# Altium project 迷你打印机.PrjPcb
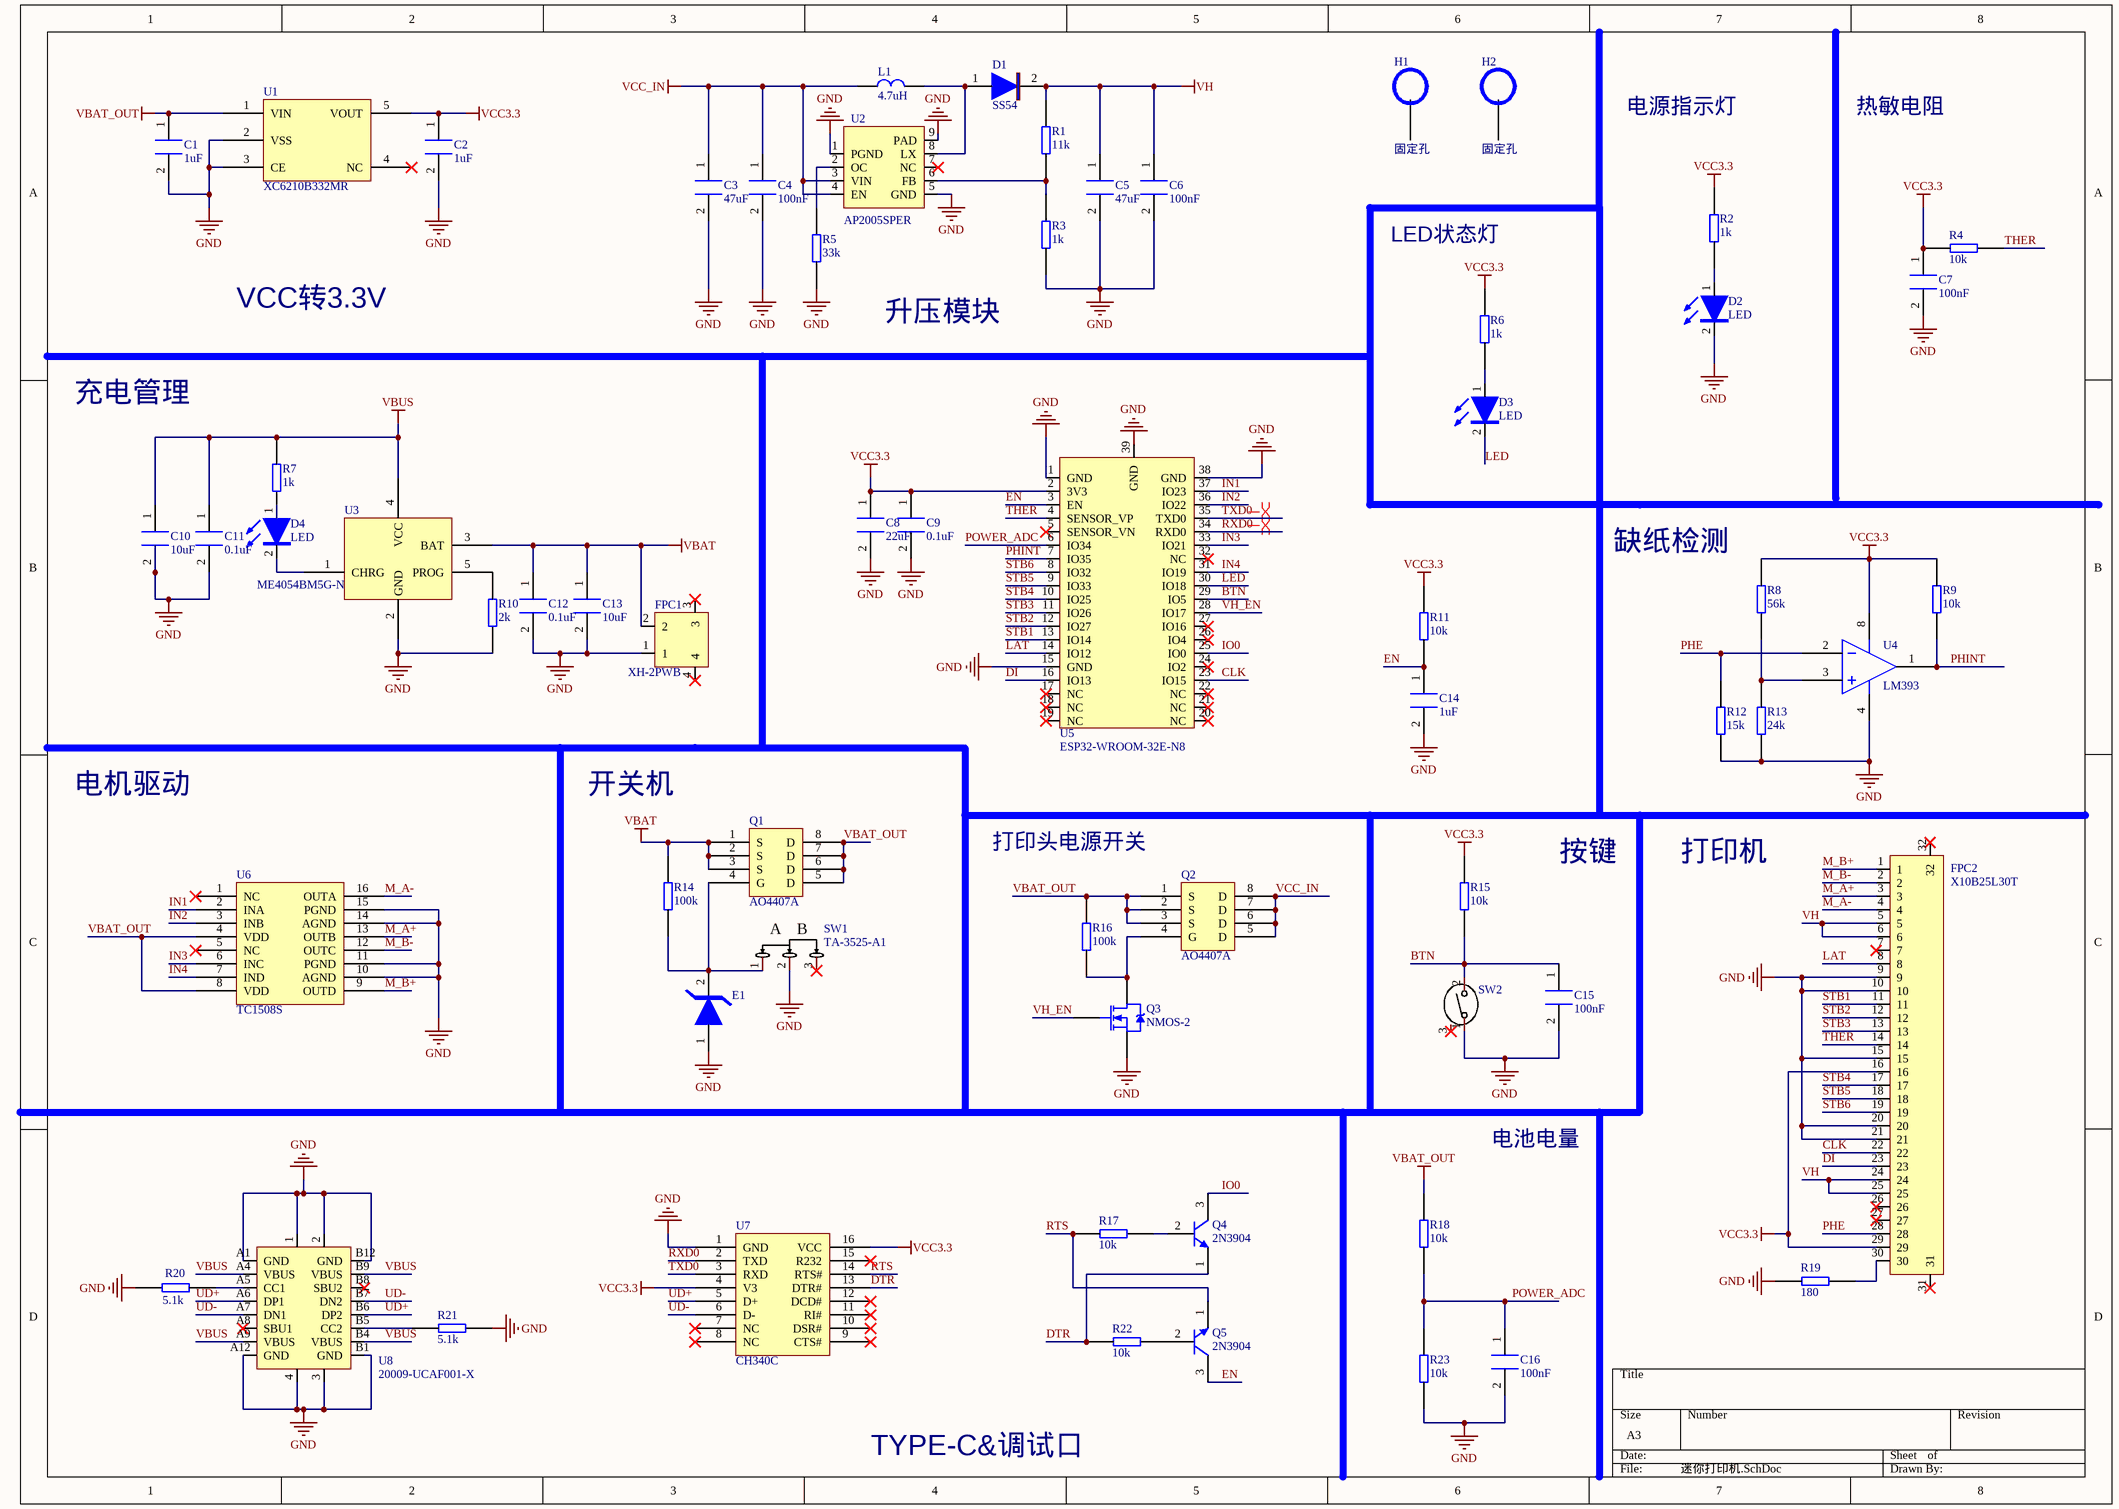
[diagram p0: 迷你打印机.SchDoc]
1 sheet, 64 parts. Net scope: global (net labels, ports and power ports of the same name join across sheets).
Board file: 迷你打印机.PcbDoc

## Sheet 迷你打印机.SchDoc
size A3

### Parts
C1  1uF  [0603C]
C2  1uF  [0603C]
C3  47uF  [0603C]
C4  100nF  [0603C]
C5  47uF  [0603C]
C6  100nF  [0603C]
C7  100nF  [0603C]
C8  22uF  [0603C]
C9  0.1uF  [0603C]
C10  10uF  [0603C]
C11  0.1uF  [0603C]
C12  0.1uF  [0603C]
C13  10uF  [0603C]
C14  1uF  [0603C]
C15  100nF  [0603C]
C16  100nF  [0603C]
D1  SS54  [SMA]
D2  LED  [0805D]
D3  LED  [0805D]
D4  LED  [0805D]
E1  单向ESD  [SOD323]  (value not drawn)
FPC1  XH-2PWB  [CONN-SMD_2P-P2.50_XH-2PWB]
FPC2  X10B25L30T  [FPC-SMD_X10B25U30T]
H1  固定孔  [铜柱孔3]
H2  固定孔  [铜柱孔3]
L1  4.7uH  [IND-SMD_L5.4-W5.2_FXL0530]
Q1  AO4407A  [SOP8]
Q2  AO4407A  [SOP8]
Q3  NMOS-2  [SOT23-3]
Q4  2N3904  [SOT23-3]
Q5  2N3904  [SOT23-3]
R1  11k  [0603R]
R2  1k  [0603R]
R3  1k  [0603R]
R4  10k  [0603R]
R5  33k  [0603R]
R6  1k  [0603R]
R7  1k  [0603R]
R8  56k  [0603R]
R9  10k  [0603R]
R10  2k  [0603R]
R11  10k  [0603R]
R12  15k  [0603R]
R13  24k  [0603R]
R14  100k  [0603R]
R15  10k  [0603R]
R16  100k  [0603R]
R17  10k  [0603R]
R18  10k  [0603R]
R19  180  [0603R]
R20  5.1k  [0603R]
R21  5.1k  [0603R]
R22  10k  [0603R]
R23  10k  [0603R]
SW1  TA-3525-A1  [SW-SMD_3P-L9.1-W3.5-P2.50-EH6.8]
SW2  TS4538B3JTP 250gf 121  [KEY-SMD_3P-L4.5-W3.8-P3.00-LS4.5-BL]  (value not drawn)
U1  XC6210B332MR  [SOT23-5]
U2  AP2005SPER  [ESOP-8_L4.9-W3.9-P1.27-LS6.0-BL-EP]
U3  ME4054BM5G-N  [SOT23-5]
U4  LM393  [SOP8]
U5  ESP32-WROOM-32E-N8  [WIFI-SMD_ESP32-WROOM-32E]
U6  TC1508S  [SOP16]
U7  CH340C  [SOP16]
U8  20009-UCAF001-X  [TYPE-C-SMD_20009-UCAF001-X]

### Nets
GND: C1.2 C2.2 C3.2 C4.2 C5.2 C6.2 C7.2 C8.2 C9.2 C10.2 C11.2 C12.2 C13.2 C14.2 C15.2 C16.2 D2.2 E1.1 FPC1.1 FPC2.9 FPC2.10 FPC2.15 FPC2.20 FPC2.21 Q3.3(S) R3.2 R5.2 R10.1 R12.1 R13.1 R19.2 R20.1 R21.1 R23.2 SW1.2 SW2.1 U1.2(VSS) U1.3(CE) U2.1(PGND) U2.5(GND) U2.9(PAD) U3.2(GND) U4.4(V-) U5.1(GND) U5.15(GND) U5.38(GND) U5.39(GND) U6.10(AGND) U6.11(PGND) U6.14(AGND) U6.15(PGND) U7.1(GND) U8.1 U8.2 U8.3 U8.4 U8.A1(GND) U8.A12(GND) U8.B1(GND) U8.B12(GND)
VBAT: C12.1 C13.1 FPC1.2 Q1.1(S) Q1.2(S) Q1.3(S) R14.1 U3.3(BAT)
VBAT_OUT: C1.1 Q1.5(D) Q1.6(D) Q1.7(D) Q1.8(D) Q2.1(S) Q2.2(S) Q2.3(S) R16.1 R18.1 U1.1(VIN) U6.4(VDD) U6.8(VDD)
VBUS: C10.1 C11.1 R7.2 U3.4(VCC) U8.A4(VBUS) U8.A9(VBUS) U8.B4(VBUS) U8.B9(VBUS)
VCC3.3: C2.1 C7.1 C8.1 C9.1 FPC2.16 FPC2.29 R2.1 R4.2 R6.1 R8.2 R9.2 R11.1 R15.2 U1.5(VOUT) U4.8(V+) U5.2(3V3) U7.4(V3) U7.16(VCC)
VCC_IN: C3.1 C4.1 L1.1 Q2.5(D) Q2.6(D) Q2.7(D) Q2.8(D) U2.3(VIN) U2.4(EN)
VH: C5.1 C6.1 D1.2 FPC2.5 FPC2.6 FPC2.24 FPC2.25 R1.1
BTN: C15.1 R15.1 SW2.2 U5.29(IO5)
CLK: FPC2.22 U5.23(IO15)
DI: FPC2.23 U5.16(IO13)
DTR: Q4.1 R22.2 U7.13(DTR#)
EN: C14.1 Q5.3 R11.2 U5.3(EN)
IN1: U5.37(IO23) U6.2(INA)
IN2: U5.36(IO22) U6.3(INB)
IN3: U5.33(IO21) U6.6(INC)
IN4: U5.31(IO19) U6.7(IND)
IO0: Q4.3 U5.25(IO0)
LAT: FPC2.8 U5.14(IO12)
LED: D3.2 U5.30(IO18)
M_A+: FPC2.3 U6.13(OUTB)
M_A-: FPC2.4 U6.16(OUTA)
M_B+: FPC2.1 U6.9(OUTD)
M_B-: FPC2.2 U6.12(OUTC)
PHE: FPC2.28 R12.2 U4.2(IN-)
PHINT: R9.1 U4.1(OUT) U5.7(IO35)
POWER_ADC: C16.1 R18.2 R23.1 U5.6(IO34)
RTS: Q5.1 R17.2 U7.14(RTS#)
RXD0: U5.34(RXD0) U7.2(TXD)
STB1: FPC2.11 U5.13(IO14)
STB2: FPC2.12 U5.12(IO27)
STB3: FPC2.13 U5.11(IO26)
STB4: FPC2.17 U5.10(IO25)
STB5: FPC2.18 U5.9(IO33)
STB6: FPC2.19 U5.8(IO32)
THER: FPC2.14 R4.1 U5.4(SENSOR_VP)
TXD0: U5.35(TXD0) U7.3(RXD)
UD+: U7.5(D+) U8.A6(DP1) U8.B6(DP2)
UD-: U7.6(D-) U8.A7(DN1) U8.B7(DN2)
VH_EN: Q3.1(G) U5.28(IO17)
NetD1_1: D1.1 L1.2 U2.8(LX)
NetD2_1: D2.1 R2.2
NetD3_1: D3.1 R6.2
NetD4_1: D4.1 R7.1
NetD4_2: D4.2 U3.1(CHRG)
NetE1_2: E1.2 Q1.4(G) R14.2 SW1.1
NetFPC2_30: FPC2.30 R19.1
NetQ2_4: Q2.4(G) Q3.2(D) R16.2
NetQ4_2: Q4.2 R17.1
NetQ5_2: Q5.2 R22.1
NetR1_2: R1.2 R3.1 U2.6(FB)
NetR5_1: R5.1 U2.2(OC)
NetR8_1: R8.1 R13.2 U4.3(IN+)
NetR10_2: R10.2 U3.5(PROG)
NetR20_2: R20.2 U8.A5(CC1)
NetR21_2: R21.2 U8.B5(CC2)

Not connected (* = marked no-connect by the designer): FPC1 3* 4*; FPC2 7* 26* 27* 31* 32*; H1 11; H2 11; SW1 3*; SW2 3(EP)*; U1 4(NC)*; U2 7(NC)*; U5 5(SENSOR_VN)* 17(NC)* 18(NC)* 19(NC)* 20(NC)* 21(NC)* 22(NC)* 24(IO2)* 26(IO4)* 27(IO16)* 32(NC)*; U6 1(NC)* 5(NC)*; U7 7(NC)* 8(NC)* 9(CTS#)* 10(DSR#)* 11(RI#)* 12(DCD#)* 15(R232)*; U8 A8(SBU1)* B8(SBU2)*

### Layout directives
differential pair: (no net found under the mark)

### Notes on the sheet
- 电源指示灯
- 热敏电阻
- LED状态灯
- VCC转3.3V
- 升压模块
- 充电管理
- 缺纸检测
- 电机驱动
- 开关机
- 打印头电源开关
- 按键
- 打印机
- 电池电量
- TYPE-C&调试口
- (in symbol TA-3525-A1) A; B

### Library data of the parts
C1-C16 = CAP: 电容
D1 = SS54: 二极管
FPC2 = X10B25L30T: Manufacturer: XKB Connectivity(中国星坤); Add into BOM: yes; Locking Feature: 抽屉式; Number of Contacts: 30P; Pitch: 1mm; FFC, FCB Thickness: 0.3mm; Soldering Temperature(Max): 260℃; Symbol: X10B25L30T; Device: X10B25L30T; Supplier: LCSC; Supplier Part: C500182; Manufacturer Part: X10B25L30T; LCSC Part Name: 间距:1mm P数:30P 抽屉式 下接; Supplier Footprint: SMD,P=1mm,卧贴; Datasheet: https://atta.szlcsc.com/upload/public/pdf/source/20211011/C16FFC4EB876FDA360008692BDE0DBBC.pdf; Convert to PCB: yes; Contact Type: 下接; Mounting Type: 卧贴; Height Above Board: 2.5mm; Contact Material: 磷青铜; Contact Plating: 锡; Operating Temperature Range: -40℃~+85℃
L1 = INDUCTOR2: 电感
Q1 Q2 = AO4407A: 二极管
Q3 = NMOS-2: N-Channel Power MOSFET; Note: Pin 2 is electrically connected to pin 4.; Published: 8-Jun-2000; LatestRevisionDate: 17-Jul-2002; LatestRevisionNote: Re-released for DXP Platform.; DatasheetVersion: PD-9.814; PackageVersion: Feb-1997; PackageReference: TO-220AB; Publisher: Altium Limited; PackageDescription: TO, Thru-Hole, Vertical, Heatsink Mounted; 3 In-Line Leads; Pitch 2.54 mm; ComponentLink1Description: Manufacturer Link; ComponentLink1URL: http://www.irf.com/
Q4 Q5 = 2N3904: NPN General Purpose Amplifier; Published: 8-Jun-2000; LatestRevisionDate: 15-Jan-2003; LatestRevisionNote: PCB Footprint 'BCY-W3/D4.7' replaced; DatasheetDocument: 1997; PackageDocument: Sep-1998; PackageReference: TO-92A; Publisher: Altium Limited; Code_JEDEC: TO-92A; ComponentLink1Description: Manufacturer Link; ComponentLink1URL: http://www.fairchildsemi.com/; ComponentLink2Description: Datasheet; ComponentLink2URL: http://www.fairchildsemi.com/ds/2N%2F2N3904.pdf
R1-R23 = RES: 电阻
SW1 = TA-3525-A1: Manufacturer: Yuandi(元迪); Add into BOM: yes; Symbol: TA-3525-A1; Device: TA-3525-A1; Supplier: LCSC; Supplier Part: C514018; Manufacturer Part: TA-3525-A1; LCSC Part Name: 滑动开关9.1*3.5*2.0mm贴片侧拨单排三脚二档; Supplier Footprint: SMD,3.5x9.1mm; Datasheet: https://atta.szlcsc.com/upload/public/pdf/source/20200415/C514019_BD29F4555739DB2630A1255040CB70C0.pdf; Convert to PCB: yes; Name: TA-3525-A1
SW2 = TS4538B3JTP 250gf 121: 按键; Manufacturer: SHOU HAN(首韩); Add into BOM: yes; Circuit: 单刀单掷; Actuator Style: 圆形按钮; Switch Length: 4.5mm; Switch Height: 3.8mm; Strike Gundam: 不带; Contact Current: 50mA; Voltage Rating (DC): 12V; Insulation Resistance: 100MΩ; Actuator/Cap Color: 黑色; Mechanical Life: 5万次; Symbol: TS4538B3JTP 250GF 121; Device: TS4538B3JTP 250gf 121; LCSC Part Name: 4.5*4.5*3.8mm 立贴 轻触开关; Supplier Part: C2906367; Manufacturer Part: TS4538B3JTP 250gf 121; Supplier Footprint: SMD; Datasheet: https://atta.szlcsc.com/upload/public/pdf/source/20211019/CD02DA46ABCD6E05459BB66A2E36F770.pdf; Supplier: LCSC; Convert to PCB: yes; Operating Force: 250gf; Mounting Style: 立贴; Switch Width: 4.5mm; Pin Style: -; Operating Temperature: -20℃~+85℃
U1 = XC6210B332MR: IC
U2 = AP2005SPER: IC; Manufacturer: chipown(芯朋微电子); Add into BOM: yes; Function: 升压型; Input Voltage: 2.5V~5.5V; Output Voltage: 9V; Switching Frequency: 1MHz; Synchronous Rectification: 否; Number of Outputs: 1; Topology: 升压式; Switch tube (built-in/external): 内置; Symbol: AP2005SPER; Device: AP2005SPER; Supplier: LCSC; Manufacturer Part: AP2005SPER; Supplier Part: C130340; LCSC Part Name: AP2005SPER; Supplier Footprint: ESOP-8; Datasheet: https://atta.szlcsc.com/upload/public/pdf/source/20170918/C130340_1505703385511975250.pdf; Convert to PCB: yes; Output Current (Max): -
U3 = ME4054BM5G-N: IC
U4 = LM393: 放大器; Published: 8-Jun-2000; LatestRevisionDate: 17-Jul-2002; LatestRevisionNote: Re-released for DXP Platform.; DatasheetVersion: REV. B; PackageVersion: 1990; PackageReference: H-08A; Publisher: Altium Limited; PackageDescription: Can; 8 Leads; Pin Circle Dia. 5.08 mm; Lead Dia. 0.53 mm (max); ComponentLink1Description: Manufacturer Link; ComponentLink1URL: http://www.analog.com/
U5 = ESP32-WROOM-32E-N8: IC; Manufacturer: ESPRESSIF(乐鑫); Symbol: ESP32-WROOM-32E(8MB); Add into BOM: yes; Device: ESP32-WROOM-32E-N8; Supplier: LCSC; Supplier Part: C701342; Manufacturer Part: ESP32-WROOM-32E-N8; LCSC Part Name: 通用型Wi-Fi+BT+BLE MCU模组; Supplier Footprint: SMD,18x25.5mm; Datasheet: https://atta.szlcsc.com/upload/public/pdf/source/20200730/C701341_95E089979D39CD8D2471FDC7C7AF29A1.pdf; Convert to PCB: yes
U6 = TC1508S: IC
U7 = CH340C: IC
U8 = 20009-UCAF001-X: IC; Manufacturer: MINTRON(明硕); Add into BOM: yes; Symbol: 20009-UCAF001-X; Device: 20009-UCAF001-X; Supplier: LCSC; Supplier Part: C3148200; Manufacturer Part: 20009-UCAF001-X; LCSC Part Name: 20009-UCAF001-X; Supplier Footprint: SMD; Datasheet: https://atta.szlcsc.com/upload/public/pdf/source/20220705/4C04992B6F70FB490BC74B4779796E6C.pdf; Convert to PCB: yes